# EAGLE schematic r10.0_328_1284 (EAGLE 8.4.2)
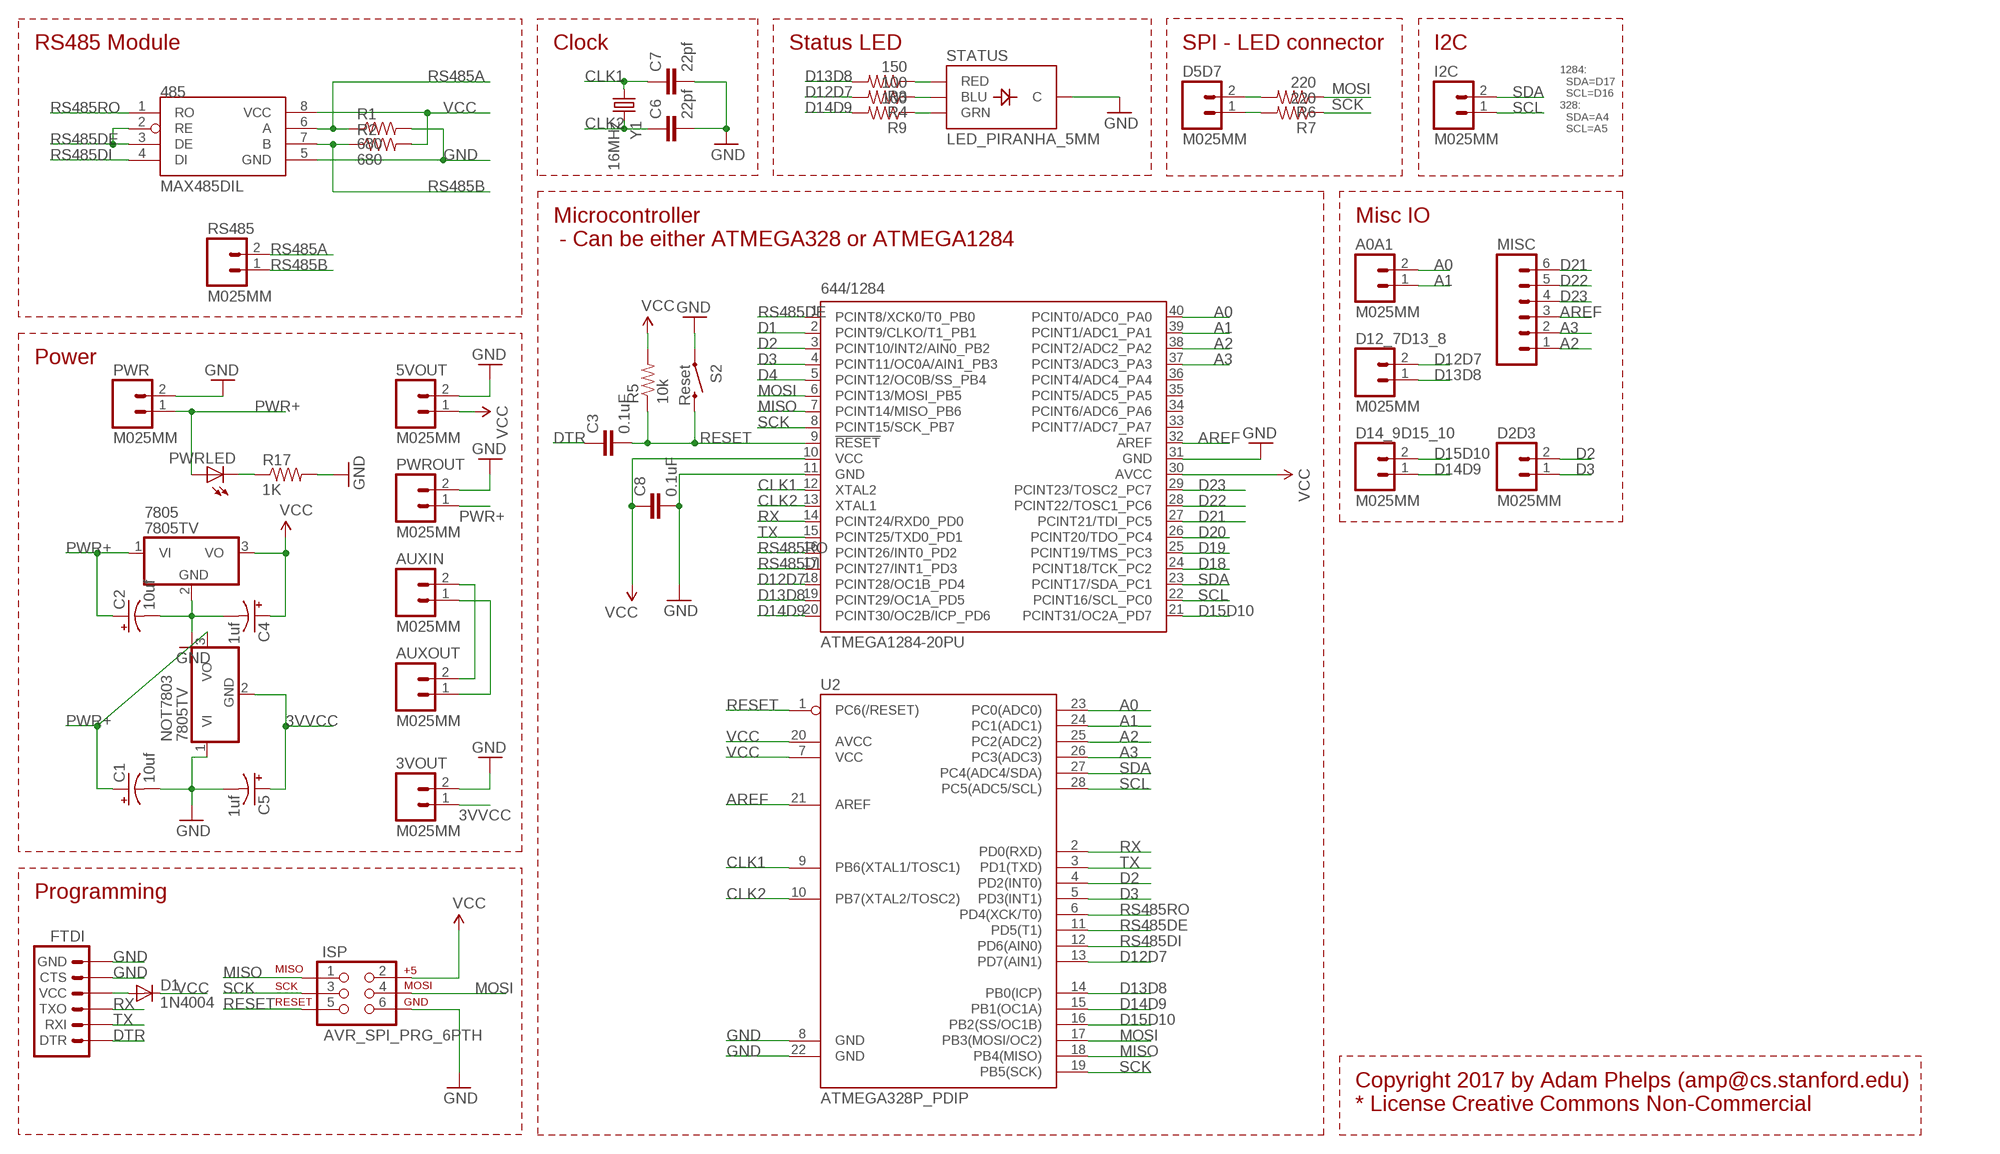
[diagram p0: schematic, sheet 1]

## Parts
3VOUT  M025MM  [SCREWTERMINAL-5MM-2]
5VOUT  M025MM  [SCREWTERMINAL-5MM-2]
485  MAX485DIL  [DIL08]
644/1284  ATMEGA1284-20PU  ATMEGA644-20PU  [DIL40]
7805  7805TV  [TO220V]
A0A1  M025MM  [SCREWTERMINAL-5MM-2]
AUXIN  M025MM  [SCREWTERMINAL-5MM-2]
AUXOUT  M025MM  [SCREWTERMINAL-5MM-2]
C1  10uf  CAP_POLPTH2  [CPOL-RADIAL-10UF-25V]
C2  10uf  CAP_POLPTH2  [CPOL-RADIAL-10UF-25V]
C3  0.1uF  CAPPTH  [CAP-PTH-SMALL]
C4  1uf  CAP_POLPTH2  [CPOL-RADIAL-10UF-25V]
C5  1uf  CAP_POLPTH2  [CPOL-RADIAL-10UF-25V]
C6  22pf  CAPPTH  [CAP-PTH-SMALL]
C7  22pf  CAPPTH  [CAP-PTH-SMALL]
C8  0.1uF  CAPPTH  [CAP-PTH-SMALL]
D1  1N4004  [DO41-10]
D2D3  M025MM  [SCREWTERMINAL-5MM-2]
D5D7  M025MM  [SCREWTERMINAL-5MM-2]
D12_7D13_8  M025MM  [SCREWTERMINAL-5MM-2]
D14_9D15_10  M025MM  [SCREWTERMINAL-5MM-2]
FTDI  ARDUINO_SERIAL_PROGRAMPTH  [1X06]
I2C  M025MM  [SCREWTERMINAL-5MM-2]
ISP  AVR_SPI_PRG_6PTH  [2X3]
MISC  M06NO_SILK  [1X06_NO_SILK]
NOT7803  7805TV  [TO220V]
PWR  M025MM  [SCREWTERMINAL-5MM-2]
PWRLED  LED5MM  [LED5MM]
PWROUT  M025MM  [SCREWTERMINAL-5MM-2]
R1  680  RESISTORPTH-1/4W  [AXIAL-0.4]
R2  680  RESISTORPTH-1/4W  [AXIAL-0.4]
R3  150  RESISTORPTH-1/4W  [AXIAL-0.4]
R4  100  RESISTORPTH-1/4W  [AXIAL-0.4]
R5  10k  RESISTORPTH-1/4W  [AXIAL-0.4]
R6  220  RESISTORPTH-1/4W  [AXIAL-0.4]
R7  220  RESISTORPTH-1/4W  [AXIAL-0.4]
R9  100  RESISTORPTH-1/4W  [AXIAL-0.4]
R17  1K  RESISTORPTH-1/4W  [AXIAL-0.4]
RS485  M025MM  [SCREWTERMINAL-5MM-2]
S2  Reset  SWITCH-MOMENTARY-2SMD  [TACTILE_SWITCH_SMD]
STATUS  LED_PIRANHA_5MM  [LED_PIRANHA_5MM]
U2  ATMEGA328P_PDIP  [DIL28-3]
Y1  16MHz  CRYSTALHC49US  [HC49US]

## Nets
3VVCC: 3VOUT.1 C5.1(+) NOT7803.2(GND)
A0: 644/1284.40(PCINT0/ADC0_PA0) A0A1.2 U2.23(PC0(ADC0))
A1: 644/1284.39(PCINT1/ADC1_PA1) A0A1.1 U2.24(PC1(ADC1))
A2: 644/1284.38(PCINT2/ADC2_PA2) MISC.1 U2.25(PC2(ADC2))
A3: 644/1284.37(PCINT3/ADC3_PA3) MISC.2 U2.26(PC3(ADC3))
AREF: 644/1284.32(AREF) MISC.3 U2.21(AREF)
CLK1: 644/1284.12(XTAL2) C7.1 U2.9(PB6(XTAL1/TOSC1)) Y1.1
CLK2: 644/1284.13(XTAL1) C6.1 U2.10(PB7(XTAL2/TOSC2)) Y1.2
D1: 644/1284.2(PCINT9/CLKO/T1_PB1)
D2: 644/1284.3(PCINT10/INT2/AIN0_PB2) D2D3.2 U2.4(PD2(INT0))
D3: 644/1284.4(PCINT11/OC0A/AIN1_PB3) D2D3.1 U2.5(PD3(INT1))
D4: 644/1284.5(PCINT12/OC0B/SS_PB4)
D12D7: 644/1284.18(PCINT28/OC1B_PD4) D12_7D13_8.2 R4.P$2 U2.13(PD7(AIN1))
D13D8: 644/1284.19(PCINT29/OC1A_PD5) D12_7D13_8.1 R3.P$2 U2.14(PB0(ICP))
D14D9: 644/1284.20(PCINT30/OC2B/ICP_PD6) D14_9D15_10.1 R9.P$2 U2.15(PB1(OC1A))
D15D10: 644/1284.21(PCINT31/OC2A_PD7) D14_9D15_10.2 U2.16(PB2(SS/OC1B))
D18: 644/1284.24(PCINT18/TCK_PC2)
D19: 644/1284.25(PCINT19/TMS_PC3)
D20: 644/1284.26(PCINT20/TDO_PC4)
D21: 644/1284.27(PCINT21/TDI_PC5) MISC.6
D22: 644/1284.28(PCINT22/TOSC1_PC6) MISC.5
D23: 644/1284.29(PCINT23/TOSC2_PC7) MISC.4
DTR: C3.1 FTDI.DTR
GND: 3VOUT.2 5VOUT.2 485.5(GND) 644/1284.11(GND) 644/1284.31(GND) 7805.2(GND) C1.2(-) C2.2(-) C4.2(-) C5.2(-) C6.2 C7.2 C8.2 FTDI.CTS FTDI.GND ISP.6 NOT7803.1(VI) PWR.2 PWROUT.2 R1.P$2 R17.P$2 S2.1 STATUS.-(C) U2.8(GND) U2.22(GND)
MISO: 644/1284.7(PCINT14/MISO_PB6) ISP.1 U2.18(PB4(MISO))
MOSI: 644/1284.6(PCINT13/MOSI_PB5) ISP.4 R6.P$1 U2.17(PB3(MOSI/OC2))
N$1: PWRLED.K(C) R17.P$1
N$2: AUXIN.1 AUXOUT.1
N$3: AUXIN.2 AUXOUT.2
N$4: D5D7.2 R6.P$2
N$5: R3.P$1 STATUS.R(RED)
N$6: R4.P$1 STATUS.B(BLU)
N$7: R9.P$1 STATUS.G(GRN)
N$8: D5D7.1 R7.P$2
N$9: D1.A FTDI.VCC
PWR+: 7805.1(VI) C1.1(+) C2.1(+) NOT7803.3(VO) PWR.1 PWRLED.A PWROUT.1
RESET: 644/1284.9(!RESET) C3.2 ISP.5 R5.P$1 S2.3 U2.1(PC6(/RESET))
RS485A: 485.6(A) R1.P$1 RS485.2
RS485B: 485.7(B) R2.P$1 RS485.1
RS485DE: 485.2(RE) 485.3(DE) 644/1284.1(PCINT8/XCK0/T0_PB0) U2.11(PD5(T1))
RS485DI: 485.4(DI) 644/1284.17(PCINT27/INT1_PD3) U2.12(PD6(AIN0))
RS485RO: 485.1(RO) 644/1284.16(PCINT26/INT0_PD2) U2.6(PD4(XCK/T0))
RX: 644/1284.14(PCINT24/RXD0_PD0) FTDI.TXO U2.2(PD0(RXD))
SCK: 644/1284.8(PCINT15/SCK_PB7) ISP.3 R7.P$1 U2.19(PB5(SCK))
SCL: 644/1284.22(PCINT16/SCL_PC0) I2C.1 U2.28(PC5(ADC5/SCL))
SDA: 644/1284.23(PCINT17/SDA_PC1) I2C.2 U2.27(PC4(ADC4/SDA))
TX: 644/1284.15(PCINT25/TXD0_PD1) FTDI.RXI U2.3(PD1(TXD))
VCC: 5VOUT.1 485.8(VCC) 644/1284.10(VCC) 644/1284.30(AVCC) 7805.3(VO) C4.1(+) C8.1 D1.C ISP.2 R2.P$2 R5.P$2 U2.7(VCC) U2.20(AVCC)
Unconnected: 644/1284.33(PCINT7/ADC7_PA7) 644/1284.34(PCINT6/ADC6_PA6) 644/1284.35(PCINT5/ADC5_PA5) 644/1284.36(PCINT4/ADC4_PA4)

## Notes on the sheet
- RS485 Module | Clock | Status LED | SPI - LED connector | I2C
- 1284:
    SDA=D17
    SCL=D16
  328:
    SDA=A4
    SCL=A5
- Microcontroller
   - Can be either ATMEGA328 or ATMEGA1284
- Misc IO
- Power
- Programming
- Copyright 2017 by Adam Phelps (amp@cs.stanford.edu)
  * License Creative Commons Non-Commercial

## Library data of the parts
3VOUT 5VOUT A0A1 AUXIN AUXOUT D2D3 D5D7 D12_7D13_8 D14_9D15_10 I2C PWR PWROUT RS485 = SparkFun-Connectors:M02: Standard 2-pin 0.1" header. Use with - straight break away headers ( PRT-00116) - right angle break away headers (PRT-00553) - swiss pins (PRT-00743) - machine pins (PRT-00117) - female headers (PRT-00115) Molex polarized connector foot print use with: PRT-08233 with associated crimp pins and housings. 2.54_SCREWTERM for use with PRT-10571. 3.5mm Screw Terminal footprints for PRT-08084 5mm Screw Terminal footprints for use with PRT-08433
485 = SparkFun-DigitalIC:MAX485: RS-485 transceiver
644/1284 = atmel:ATMEGA644-*PU: 8-bit Microcontroller with 64K Bytes In-System Programmable Flash Auto generated by make-symbol-device-package-bsdl.ulp Rev. 34 Source: http://www.atmel.com/dyn/resources/prod_documents/doc2593.pdf; MPN: ATMEGA644-20PU; OC_FARNELL: 1288340; OC_NEWARK: 23M5060
7805 NOT7803 = linear:78*: Positive VOLTAGE REGULATOR Source: http://cache.national.com/ds/LM/LM78L05.pdf http://www.fairchildsemi.com/ds/LM/LM7805.pdf
C1 C2 C4 C5 = SparkFun-Capacitors:CAP_POL: Capacitor Polarized These are standard SMD and PTH capacitors. Normally 10uF, 47uF, and 100uF in electrolytic and tantalum varieties. Always verify the external diameter of the through hole cap, it varies with capacity, voltage, and manufacturer. The EIA devices should be standard.
C3 C6-C8 = SparkFun-Capacitors:CAP: Capacitor Standard 0603 ceramic capacitor, and 0.1" leaded capacitor.
D1 = adafruit:1N4004: DIODE General purpose 1N400x type rectifier (With bigger pads) http://www.ladyada.net/library/pcb/eaglelibrary.html
FTDI = SparkFun-Connectors:ARDUINO_SERIAL_PROGRAM: FTDI connector footprints
ISP = SparkFun-Connectors:AVR_SPI_PRG_6: AVR ISP 6 Pin This is the reduced ISP connector for AVR programming. Common on Arduino. This footprint will take up less PCB space and can be used with a 10-pin to 6-pin adapter such as SKU: BOB-08508
MISC = SparkFun-Connectors:M06: Header 6 Standard 6-pin 0.1" header. Use with straight break away headers (SKU : PRT-00116), right angle break away headers (PRT-00553), swiss pins (PRT-00743), machine pins (PRT-00117), and female headers (PRT-00115). Molex polarized connector foot print use with SKU : PRT-08094 with associated crimp pins and housings. NOTES ON THE VARIANTS LOCK and LOCK_LONGPADS... This footprint was designed to help hold the alignment of a through-hole component (i.e. 6-pin header) while soldering it into place. You may notice that each hole has been shifted either up or down by 0.005 of an inch from it's more standard position (which is a perfectly straight line). This slight alteration caused the pins (the squares in the middle) to touch the edges of the holes. Because they are alternating, it causes a "brace" to hold the component in place. 0.005 has proven to be the perfect amount of "off-center" position when using our standard breakaway headers. Although looks a little odd when you look at the bare footprint, once you have a header in there, the alteration is very hard to notice. Also,if you push a header all the way into place, it is covered up entirely on the bottom side. This idea of altering the position of holes to aid alignment will be further integrated into the Sparkfun Library for other footprints. It can help hold any component with 3 or more connection pins.
PWRLED = SparkFun-LED:LED: LEDs Standard schematic elements and footprints for 5mm, 3mm, 1206, and 0603 sized LEDs. 5mm - Spark Fun Electronics SKU : COM-00529 (and others)
R1 R2 R17 = SparkFun-Resistors:RESISTOR: Resistor Basic schematic elements and footprints for 0603, 1206, and PTH resistors.
R3-R7 R9 = SparkFun-Passives:RESISTOR: Resistor Basic schematic elements and footprints for 0603, 1206, and PTH resistors.
S2 = SparkFun:SWITCH-MOMENTARY-2
STATUS = SparkFun-LED:LED_PIRANHA_5MM: High-brightness RGB through-hole LED, similar to that used in the Shiftbrite
U2 = SparkFun-DigitalIC:ATMEGA328P_PDIP: uC used in the Arduino 32kb flash, 1k EEPROM, 2k SRAM This is the through-hole version of this chip.
Y1 = SparkFun-FreqCtrl:CRYSTAL: Various standard crystals. Proven footprints. Spark Fun Electronics SKU : COM-00534

## Net classes
0 default: width 0.203 mm